# Altium schematic sheet 01 整车电源.SchDoc
size A4
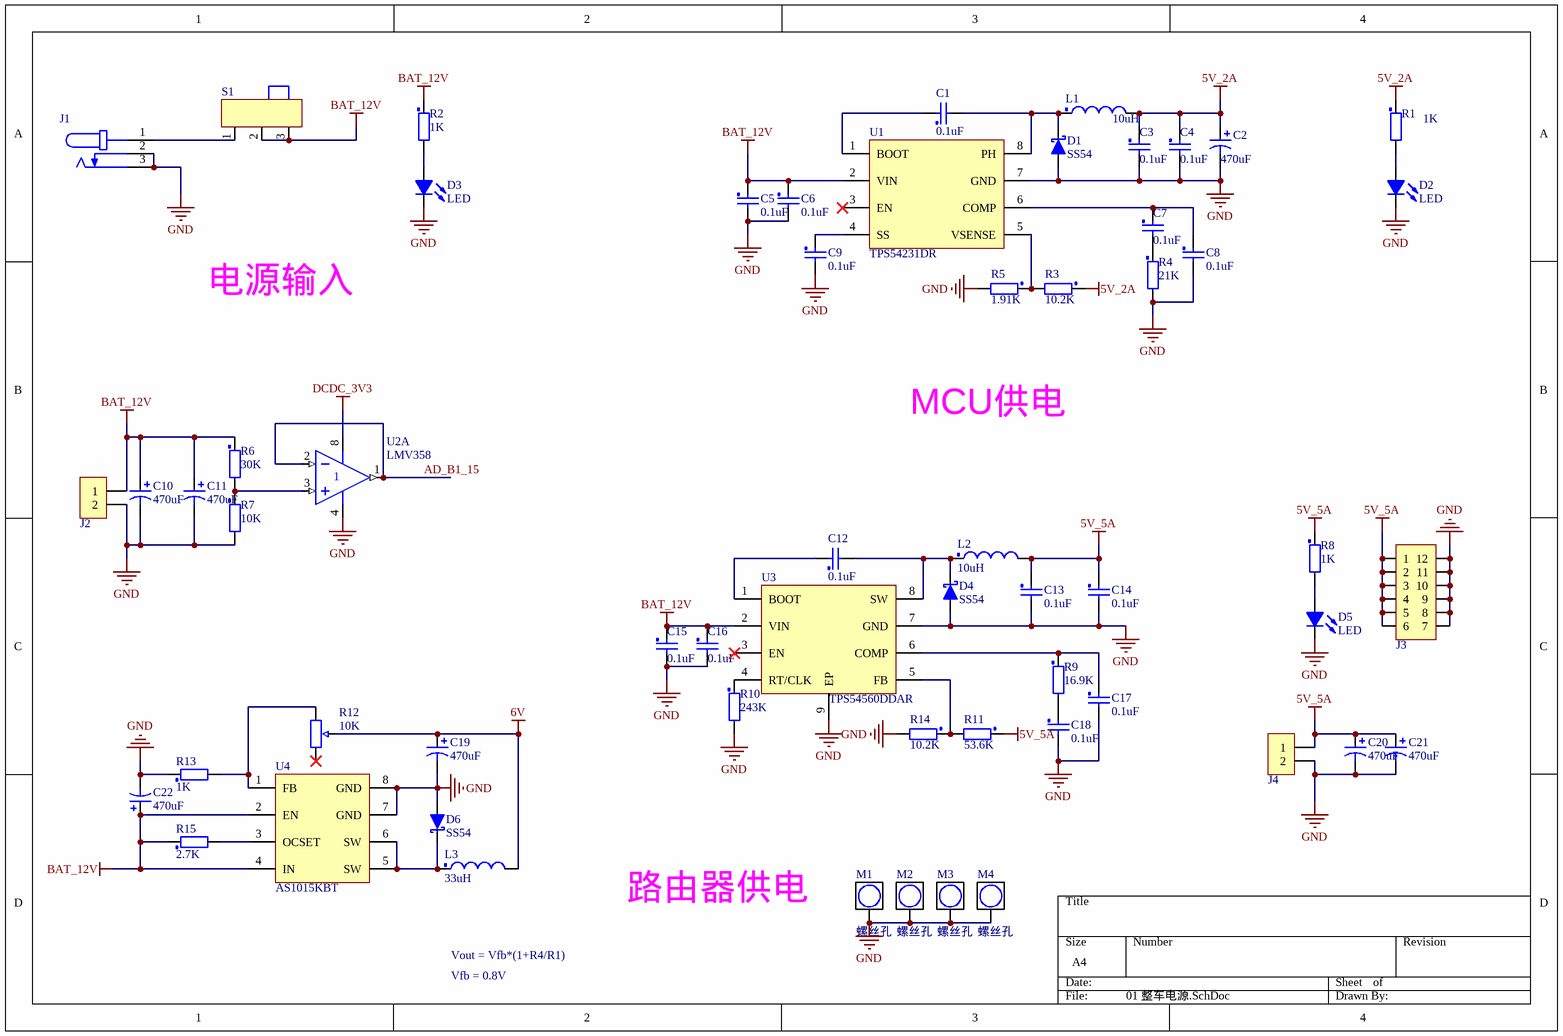
[diagram p0: 01 整车电源.SchDoc]

## Parts
C1  0.1uF  [cap0603]
C2  470uF  [Cap8x10.5mm]
C3  0.1uF  [cap0603]
C4  0.1uF  [cap0603]
C5  0.1uF  [cap0603]
C6  0.1uF  [cap0603]
C7  0.1uF  [cap0603]
C8  0.1uF  [cap0603]
C9  0.1uF  [cap0603]
C10  470uF  [Cap8x10.5mm]
C11  470uF  [Cap8x10.5mm]
C12  0.1uF  [cap0603]
C13  0.1uF  [cap0603]
C14  0.1uF  [cap0603]
C15  0.1uF  [cap0603]
C16  0.1uF  [cap0603]
C17  0.1uF  [cap0603]
C18  0.1uF  [cap0603]
C19  470uF  [Cap8x10.5mm]
C20  470uF  [Cap8x10.5mm]
C21  470uF  [Cap8x10.5mm]
C22  470uF  [Cap8x10.5mm]
D1  SS54  [SMA(DO-214AC)]
D2  LED  [LED]
D3  LED  [LED]
D4  SS54  [SMA(DO-214AC)]
D5  LED  [LED]
D6  SS54  [SMA(DO-214AC)]
J1  DC输入插座  [DC_IN]  (value not drawn)
J2  接插件1  [5.08_2p]  (value not drawn)
J3  2x6  [2*8]  (value not drawn)
J4  接插件1  [5.08_2p]  (value not drawn)
L1  10uH  [CD43]
L2  10uH  [CD43]
L3  33uH  [CD43]
M1  螺丝孔  [螺丝孔]
M2  螺丝孔  [螺丝孔]
M3  螺丝孔  [螺丝孔]
M4  螺丝孔  [螺丝孔]
R1  1K  [res0603]
R2  1K  [res0603]
R3  10.2K  [res0603]
R4  21K  [res0603]
R5  1.91K  [res0603]
R6  30K  [res0603]
R7  10K  [res0603]
R8  1K  [res0603]
R9  16.9K  [res0603]
R10  243K  [res0603]
R11  53.6K  [res0603]
R12  10K  [3266W]
R13  1K  [res0603]
R14  10.2K  [res0603]
R15  2.7K  [res0603]
S1  小型扭子开关  [3p-switch]  (value not drawn)
U1  TPS54231DR  [SOIC-8_150mil]
U2  LMV358  [OPA2350]  (part A of 2)
U3  TPS54560DDAR  [SOIC-8_EP_150mil]
U4  AS1015KBT  [SOP18-AS1015]

## Nets
5V_2A: C2.1 C3.1 C4.1 L1.2 R1.1 R3.1
5V_5A: C13.1 C14.1 C20.1 C21.1 J3.1 J3.2 J3.3 J3.4 J3.5 J3.6 J4.1 L2.2 R8.1 R11.1
6V: C19.1 L3.2 R12.2
BAT_12V: C5.1 C6.1 C10.1 C11.1 C15.1 C16.1 C22.1 J2.1 R2.1 R6.1 R15.1 S1.2 S1.3 U1.2(VIN) U3.2(VIN) U4.2(EN) U4.4(IN)
DCDC_3V3: U2.8(V+)
GND: C2.2 C3.2 C4.2 C5.2 C6.2 C8.2 C9.2 C10.2 C11.2 C13.2 C14.2 C15.2 C16.2 C17.2 C18.2 C19.2 C20.2 C21.2 C22.2 D1.1(A) D2.2(K) D3.2(K) D4.1(A) D5.2(K) D6.1(A) J1.2(GND) J1.3(GND) J2.2 J3.7 J3.8 J3.9 J3.10 J3.11 J3.12 J4.2 M1.0 M2.0 M3.0 M4.0 R4.2 R5.2 R7.2 R10.2 R13.1 R14.2 U1.7(GND) U2.4(V-) U3.7(GND) U3.9(EP) U4.7(GND) U4.8(GND)
AD_B1_15: U2.1(OUT) U2.2(IN-)
NetC1_1: C1.1 U1.1(BOOT)
NetC1_2: C1.2 D1.2(K) L1.1 U1.8(PH)
NetC7_1: C7.1 C8.1 U1.6(COMP)
NetC7_2: C7.2 R4.1
NetC9_1: C9.1 U1.4(SS)
NetC12_1: C12.1 U3.1(BOOT)
NetC12_2: C12.2 D4.2(K) L2.1 U3.8(SW)
NetC17_1: C17.1 R9.1 U3.6(COMP)
NetC18_1: C18.1 R9.2
NetD2_1: D2.1(A) R1.2
NetD3_1: D3.1(A) R2.2
NetD5_1: D5.1(A) R8.2
NetD6_2: D6.2(K) L3.1 U4.5(SW) U4.6(SW)
NetJ1_1: J1.1(VCC) S1.1
NetR3_2: R3.2 R5.1 U1.5(VSENSE)
NetR6_2: R6.2 R7.1 U2.3(IN+)
NetR10_1: R10.1 U3.4(RT/CLK)
NetR11_2: R11.2 R14.1 U3.5(FB)
NetR12_3: R12.3 R13.2 U4.1(FB)
NetR15_2: R15.2 U4.3(OCSET)

Not connected (* = marked no-connect by the designer): R12 1*; U1 3(EN)*; U3 3(EN)*

## Notes on the sheet
- 电源输入
- MCU供电
- 路由器供电
- Vout = Vfb*(1+R4/R1)
- Vfb = 0.8V

## Library data of the parts
C1 C3-C9 C12-C18 = Cap: 贴片电容; Published: 8-Jun-2000; LatestRevisionDate: 17-Jul-2002; LatestRevisionNote: Re-released for DXP Platform.; PackageReference: RAD-0.3; Publisher: Altium Limited; Value: 0.1uF
C2 C10 C11 C19-C22 = Cap Pol: 贴片电解电容 8*10.5mm; Published: 8-Jun-2000; LatestRevisionDate: 17-Jul-2002; LatestRevisionNote: Re-released for DXP Platform.; PackageReference: POLAR0.8; Publisher: Altium Limited; Value: 470uF
D1 D4 D6 = D Schottky: 肖特基二极管; Published: 8-Jun-2000; LatestRevisionDate: 17-Jul-2002; LatestRevisionNote: Re-released for DXP Platform.; PackageReference: SMB; Publisher: Altium Limited; Code_JEDEC: DO-214-AA
D2 D3 D5 = LED: 贴片LED; Published: 8-Jun-2000; LatestRevisionDate: 17-Jul-2002; LatestRevisionNote: Re-released for DXP Platform.; PackageDocument: Feb-2002; PackageReference: 3.2X1.6X1.1; Publisher: Altium Limited
J1 = DC输入插座: 型号DC-005  外径5.5内径2.1 立创编号C136744
J2 J4 = Header 2: 5.08mm拔插式阶段端子，弯针; BOM名称: 2P接插件; 版权归属: 源创客; 学习资源: www.ooocke.com
J3 = Header 6x2: 2.54mm公排针; BOM名称: 5P接插件; 版权归属: 源创客; 学习资源: www.ooocke.com
L1-L3 = Inductor: 贴片功率电感; Code_IEC: 1005; Published: 8-Jun-2000; LatestRevisionDate: 17-Jul-2002; LatestRevisionNote: Re-released for DXP Platform.; PackageReference: 0402-A; Publisher: Altium Limited; Code_JEITA: 0402
  L1 L2: Value: 10uH
  L3: Value: 33uH
R1-R11 R13-R15 = Res: 贴片电阻; Published: 8-Jun-2000; LatestRevisionDate: 17-Jul-2002; LatestRevisionNote: Re-released for DXP Platform.; PackageReference: AXIAL-0.4; Publisher: Altium Limited
  R1 R2 R8 R13: Value: 1K
  R3 R14: Value: 10.2K
  R4: Value: 21K
  R5: Value: 1.91K
  R6: Value: 30K
  R7: Value: 10K
  R9: Value: 16.9K
  R10: Value: 243K
  R11: Value: 53.6K
  R15: Value: 2.7K
R12 = Res Adj: 贴片电阻; Set Position: 0.5; Published: 8-Jun-2000; LatestRevisionDate: 17-Jul-2002; LatestRevisionNote: Re-released for DXP Platform.; PackageReference: AXIAL-0.6; Publisher: Altium Limited; Value: 10K
S1 = 小型扭子开关: 三脚二挡 型号MTS102
U1 = TPS54231DR: 开关稳压芯片,3.5V~28V输入,2A输出
U2 = LMV358: 运算放大器; Published: 17-Jul-2002; LatestRevisionDate: 13-Apr-2006; LatestRevisionNote: IPC-7351 Footprint Added.; DatasheetVersion: 1988; PackageReference: 751-02; Publisher: Altium Limited; PackageDescription: 8-Pin Small Outline Integrated Circuit 1.27 mm Pitch; Code_JEDEC: MS-012-AA; Code_IPC: SOIC127P600-8; ComponentLink1Description: Manufacturer Link; ComponentLink1URL: http://www.onsemi.com/site/products/parametrics/0,4446,251,00.html; ComponentLink2Description: Datasheet; ComponentLink2URL: http://www.onsemi.com/pub/Collateral/LM358-D.PDF
U3 = TPS54560DDAR: 开关稳压芯片,4.5V~60V输入,5A输出
U4 = AS1015KBT: 开关稳压芯片